# Altium schematic sheet 13-Counter74LS90.SchDoc
size A4
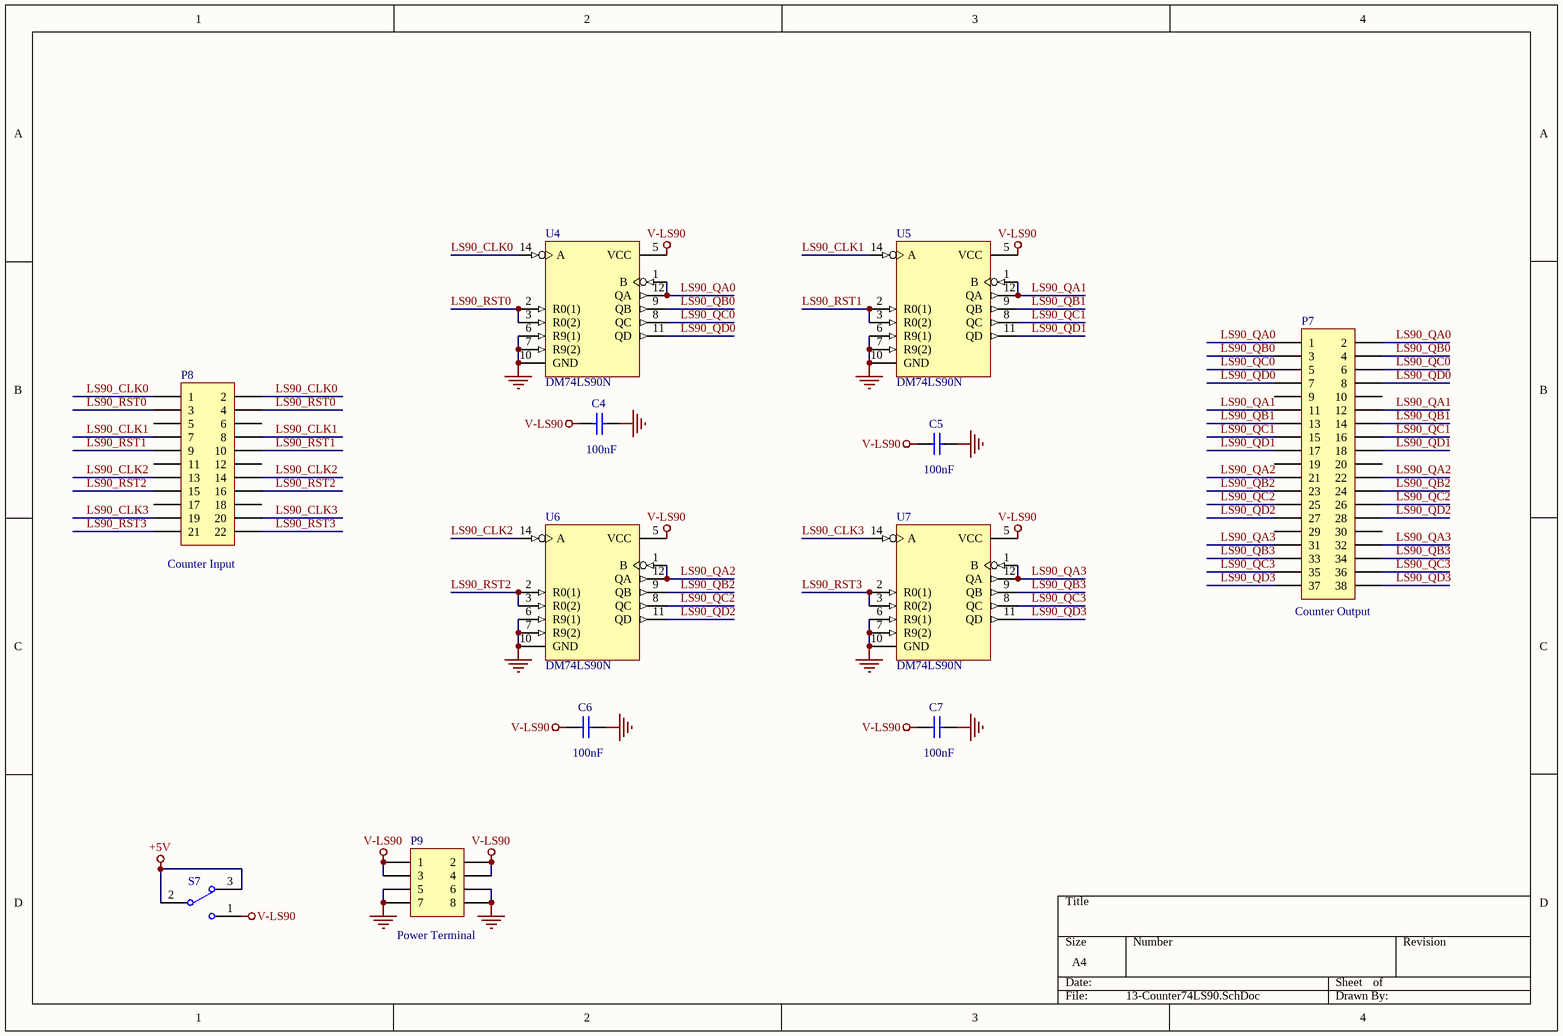
[diagram p0: 13-Counter74LS90.SchDoc]

## Parts
C4  value 100nF  [c-0805]  (hidden comment: 104)
C5  value 100nF  [c-0805]  (hidden comment: 104)
C6  value 100nF  [c-0805]  (hidden comment: 104)
C7  value 100nF  [c-0805]  (hidden comment: 104)
P7  value Counter Output  [HDR2X19]  (hidden comment: Header 19X2)
P8  value Counter Input  [HDR2X11]  (hidden comment: Header 11X2)
P9  Publisher: Power Terminal  [HDR2X4]  (hidden comment: Header 4X2)
S7  SW-SPDT  [SW-DIP1SMD]  (value not drawn)
U4  DM74LS90N  [SK-DIP14-300]
U5  DM74LS90N  [SK-DIP14-300]
U6  DM74LS90N  [SK-DIP14-300]
U7  DM74LS90N  [SK-DIP14-300]

## Nets
+5V: S7.2 S7.3
GND: C4.2 C5.2 C6.2 C7.2 P9.5 P9.6 P9.7 P9.8 U4.6(R9(1)) U4.7(R9(2)) U4.10(GND) U5.6(R9(1)) U5.7(R9(2)) U5.10(GND) U6.6(R9(1)) U6.7(R9(2)) U6.10(GND) U7.6(R9(1)) U7.7(R9(2)) U7.10(GND)
V-LS90: C4.1 C5.1 C6.1 C7.1 P9.1 P9.2 P9.3 P9.4 S7.1 U4.5(VCC) U5.5(VCC) U6.5(VCC) U7.5(VCC)
LS90_CLK0: P8.1 P8.2 U4.14(A)
LS90_CLK1: P8.7 P8.8 U5.14(A)
LS90_CLK2: P8.13 P8.14 U6.14(A)
LS90_CLK3: P8.19 P8.20 U7.14(A)
LS90_QA0: P7.1 P7.2 U4.1(B) U4.12(QA)
LS90_QA1: P7.11 P7.12 U5.1(B) U5.12(QA)
LS90_QA2: P7.21 P7.22 U6.1(B) U6.12(QA)
LS90_QA3: P7.31 P7.32 U7.1(B) U7.12(QA)
LS90_QB0: P7.3 P7.4 U4.9(QB)
LS90_QB1: P7.13 P7.14 U5.9(QB)
LS90_QB2: P7.23 P7.24 U6.9(QB)
LS90_QB3: P7.33 P7.34 U7.9(QB)
LS90_QC0: P7.5 P7.6 U4.8(QC)
LS90_QC1: P7.15 P7.16 U5.8(QC)
LS90_QC2: P7.25 P7.26 U6.8(QC)
LS90_QC3: P7.35 P7.36 U7.8(QC)
LS90_QD0: P7.7 P7.8 U4.11(QD)
LS90_QD1: P7.17 P7.18 U5.11(QD)
LS90_QD2: P7.27 P7.28 U6.11(QD)
LS90_QD3: P7.37 P7.38 U7.11(QD)
LS90_RST0: P8.3 P8.4 U4.2(R0(1)) U4.3(R0(2))
LS90_RST1: P8.9 P8.10 U5.2(R0(1)) U5.3(R0(2))
LS90_RST2: P8.15 P8.16 U6.2(R0(1)) U6.3(R0(2))
LS90_RST3: P8.21 P8.22 U7.2(R0(1)) U7.3(R0(2))

Not connected (* = marked no-connect by the designer): P7 9 10 19 20 29 30; P8 5 6 11 12 17 18

## Library data of the parts
C4-C7 = Cap: Capacitor; Published: 8-Jun-2000; LatestRevisionDate: 17-Jul-2002; LatestRevisionNote: Re-released for DXP Platform.; PackageReference: RAD-0.3; Publisher: Altium Limited; PackageDescription: Radial Cap, Thru-Hole; 2 Leads; 0.3 in Pin Spacing
P7 = Header 19X2: Header, 19-Pin, Dual row; LatestRevisionDate: 17-Jul-2002; LatestRevisionNote: Re-released for DXP Platform.
P8 = Header 11X2: Header, 11-Pin, Dual row; LatestRevisionDate: 17-Jul-2002; LatestRevisionNote: Re-released for DXP Platform.
P9 = Header 4X2: Header, 4-Pin, Dual row; LatestRevisionDate: 17-Jul-2002; LatestRevisionNote: Re-released for DXP Platform.
S7 = SW-SPDT: SPDT Subminiature Toggle Switch, Right Angle Mounting, Vertical Actuation; Published: 24-Mar-1999; LatestRevisionDate: 17-Dec-2003; LatestRevisionNote: Schematic revised, PCB Footprint replaced.; DatasheetVersion: 05-Dec-2000; PackageReference: TL36WW15050; Publisher: Altium Limited; PackageDescription: Switch; 4 Leads; ComponentLink1Description: Manufacturer Link; ComponentLink1URL: http://www.apem.com
U4-U7 = DM74LS90N: Decade and Binary Counter; Note: NC pins 4 and 13 are not drawn.; Published: 17-Jul-2002; LatestRevisionDate: 29-May-2009; LatestRevisionNote: Component Body Added.; DatasheetVersion: Mar-1998; PackageVersion: 2000; PackageReference: N14A; Publisher: Altium Limited; PackageDescription: DIP, 14-Pin, Row Spacing 7.62 mm, Pitch 2.54 mm; ComponentLink1Description: Manufacturer Link; ComponentLink1URL: http://www.fairchildsemi.com/